# Altium schematic sheet driver.SchDoc
size A4
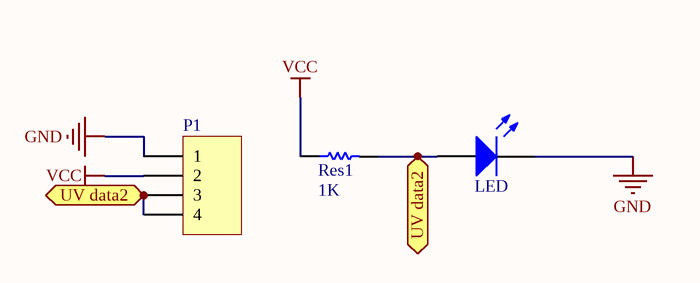
[diagram p0: driver.SchDoc]

## Parts
D?  LED  [My_LED3MM]
P1  Header 4  [My_1X04]  (value not drawn)
R?  Res1  value 1K  [AXIAL-0.3]

## Ports
UV data2

## Nets
GND: D?.K P1.1
VCC: P1.2 R?.1
UV data2: D?.A P1.3 P1.4 R?.2 ; port UV data2

## Library data of the parts
D? = LED: Typical INFRARED GaAs LED; Published: 8-Jun-2000; LatestRevisionDate: 08-Jul-2005; LatestRevisionNote: Mech Layer 1 removed.; Publisher: Altium Limited
P1 = Header 4: Header, 4-Pin; LatestRevisionDate: 17-Jul-2002; LatestRevisionNote: Re-released for DXP Platform.; Publisher: Altium Limited
R? = Res1: Resistor; Published: 8-Jun-2000; LatestRevisionDate: 17-Jul-2002; LatestRevisionNote: Re-released for DXP Platform.; PackageReference: AXIAL-0.3; Publisher: Altium Limited